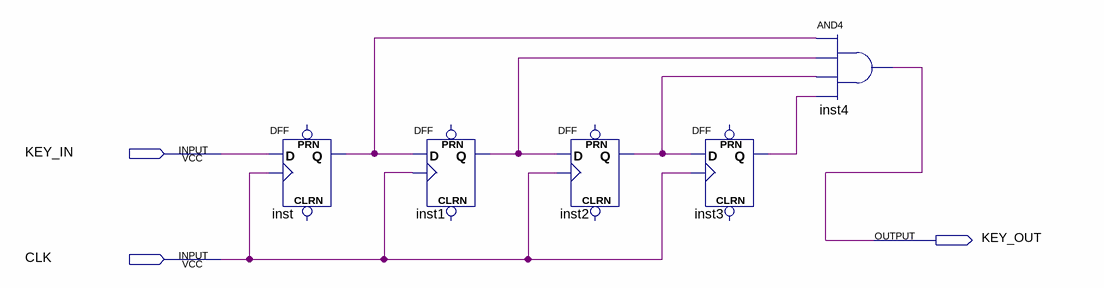
[diagram p0: schematic sheet]
// Quartus schematic button.bdf as structural Verilog: 5 symbols, 3 pins
module button (
  input  KEY_IN,
  input  CLK,
  output KEY_OUT
);

  wire inst1_q, inst2_q, inst3_q, inst_q;

  DFF inst (.CLK(CLK), .D(KEY_IN), .Q(inst_q));  // open: CLRN, PRN
  DFF inst1 (.CLK(CLK), .D(inst_q), .Q(inst1_q));  // open: CLRN, PRN
  DFF inst2 (.CLK(CLK), .D(inst1_q), .Q(inst2_q));  // open: CLRN, PRN
  DFF inst3 (.CLK(CLK), .D(inst2_q), .Q(inst3_q));  // open: CLRN, PRN
  and inst4 (KEY_OUT, inst_q, inst1_q, inst2_q, inst3_q);
endmodule
